# EAGLE design sensors (EAGLE 9.6.2)
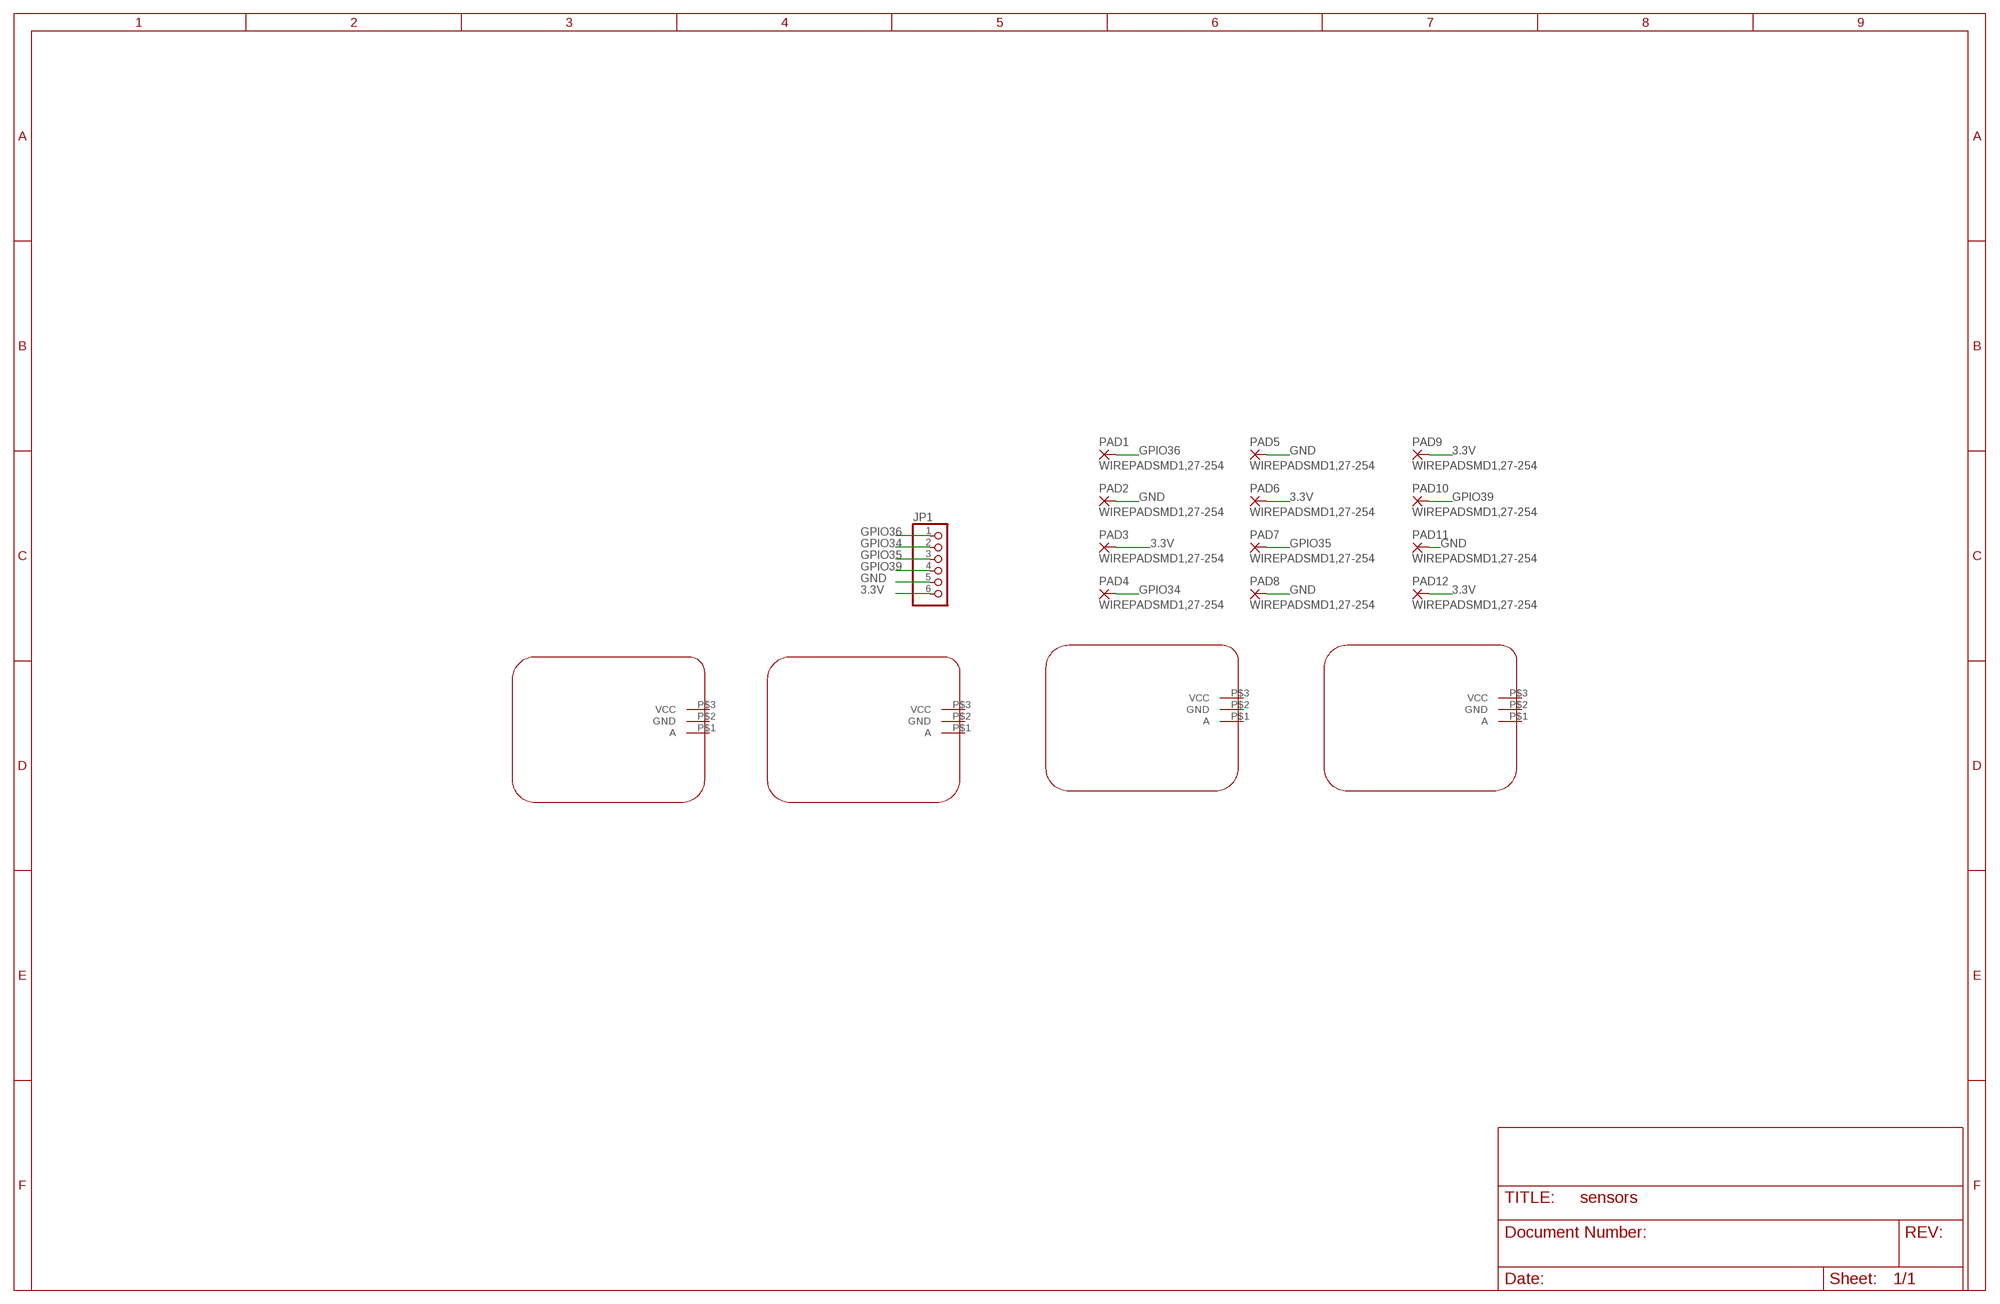
[diagram p0: schematic, sheet 1]

## Parts
JP1  PINHD-1X6  [1X06]
PAD1  WIREPADSMD1,27-254  [SMD1,27-2,54]
PAD2  WIREPADSMD1,27-254  [SMD1,27-2,54]
PAD3  WIREPADSMD1,27-254  [SMD1,27-2,54]
PAD4  WIREPADSMD1,27-254  [SMD1,27-2,54]
PAD5  WIREPADSMD1,27-254  [SMD1,27-2,54]
PAD6  WIREPADSMD1,27-254  [SMD1,27-2,54]
PAD7  WIREPADSMD1,27-254  [SMD1,27-2,54]
PAD8  WIREPADSMD1,27-254  [SMD1,27-2,54]
PAD9  WIREPADSMD1,27-254  [SMD1,27-2,54]
PAD10  WIREPADSMD1,27-254  [SMD1,27-2,54]
PAD11  WIREPADSMD1,27-254  [SMD1,27-2,54]
PAD12  WIREPADSMD1,27-254  [SMD1,27-2,54]
U$1  SEN0244  [PACKAGE]
U$2  SEN0244  [PACKAGE]
U$3  SEN0244  [PACKAGE]
U$4  SEN0244  [PACKAGE]

## Nets
3.3V: JP1.6 PAD3.1(P) PAD6.1(P) PAD9.1(P) PAD12.1(P)
GND: JP1.5 PAD2.1(P) PAD5.1(P) PAD8.1(P) PAD11.1(P)
GPIO34: JP1.2 PAD4.1(P)
GPIO35: JP1.3 PAD7.1(P)
GPIO36: JP1.1 PAD1.1(P)
GPIO39: JP1.4 PAD10.1(P)
Unconnected: U$1.P$1(A) U$1.P$2(GND) U$1.P$3(VCC) U$2.P$1(A) U$2.P$2(GND) U$2.P$3(VCC) U$3.P$1(A) U$3.P$2(GND) U$3.P$3(VCC) U$4.P$1(A) U$4.P$2(GND) U$4.P$3(VCC)

## Library data of the parts
JP1 = pinhead:PINHD-1X6: PIN HEADER
PAD1-PAD12 = wirepad:WIREPAD: Wire PAD connect wire on PCB
U$1-U$4 = untitled:SEN0244

## Board
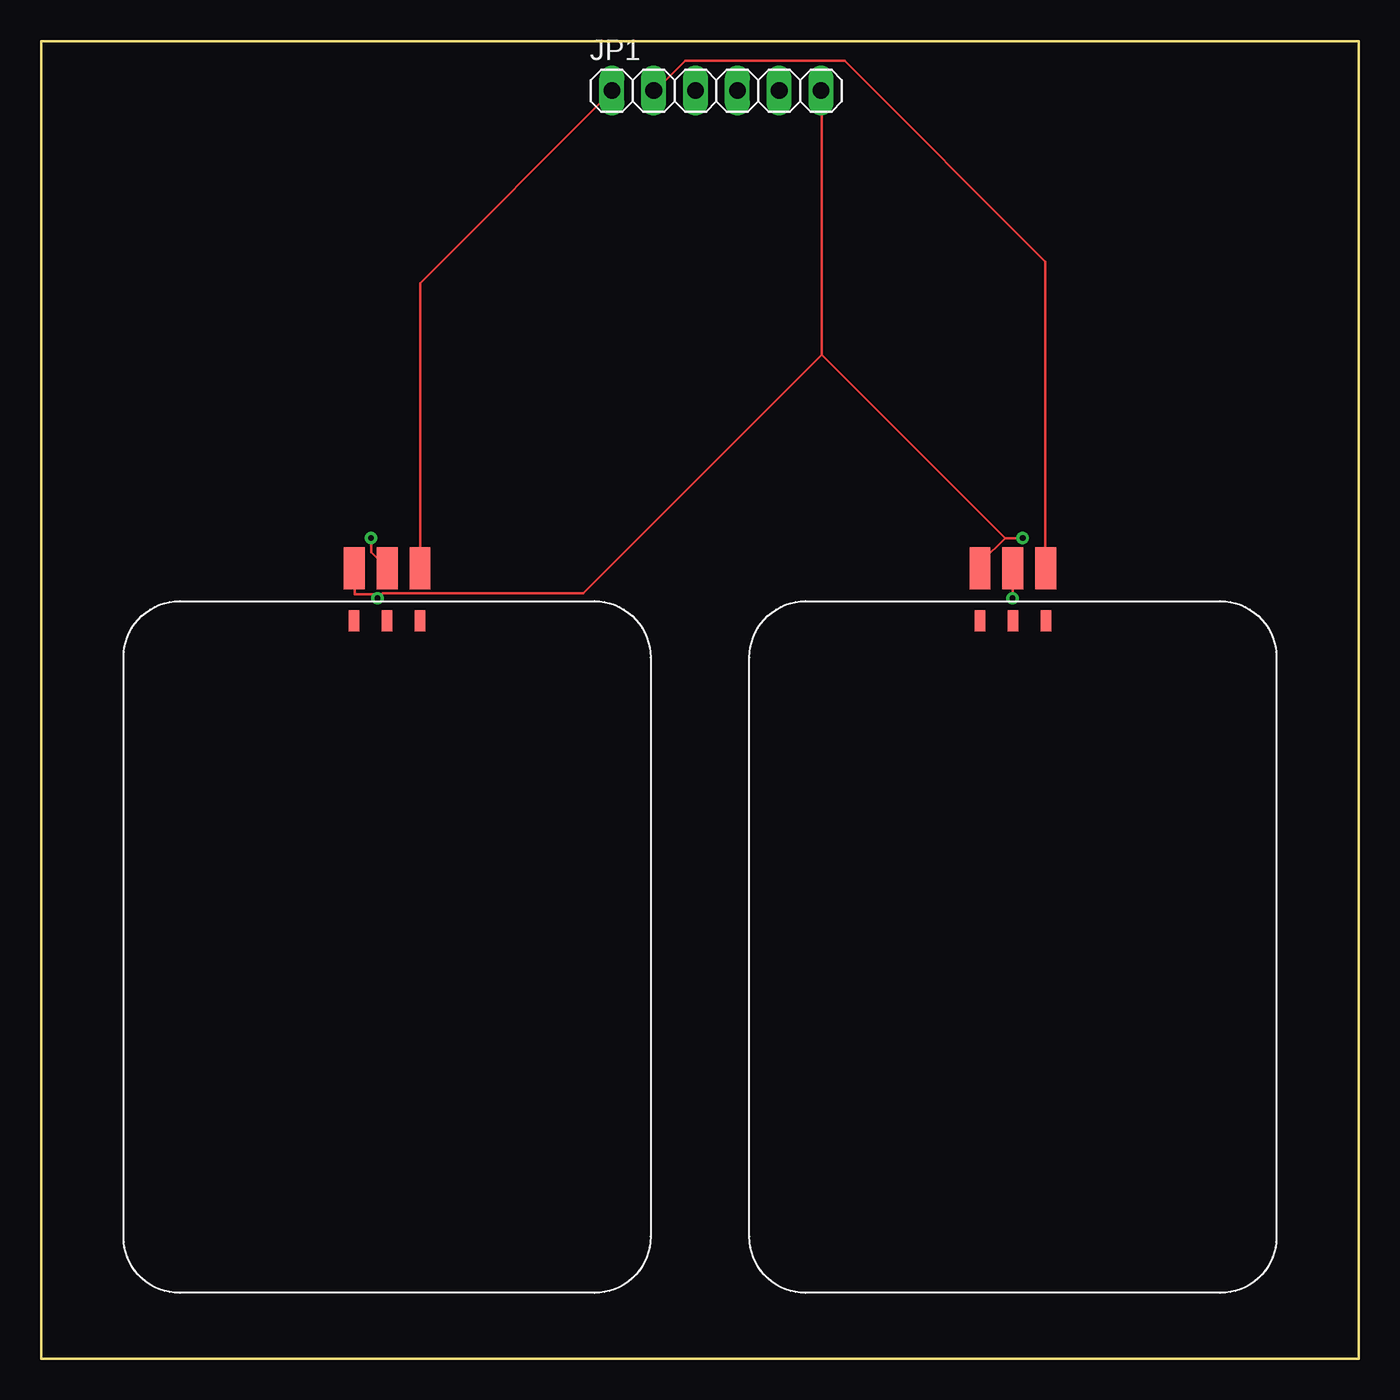
[diagram p1: board, top side]
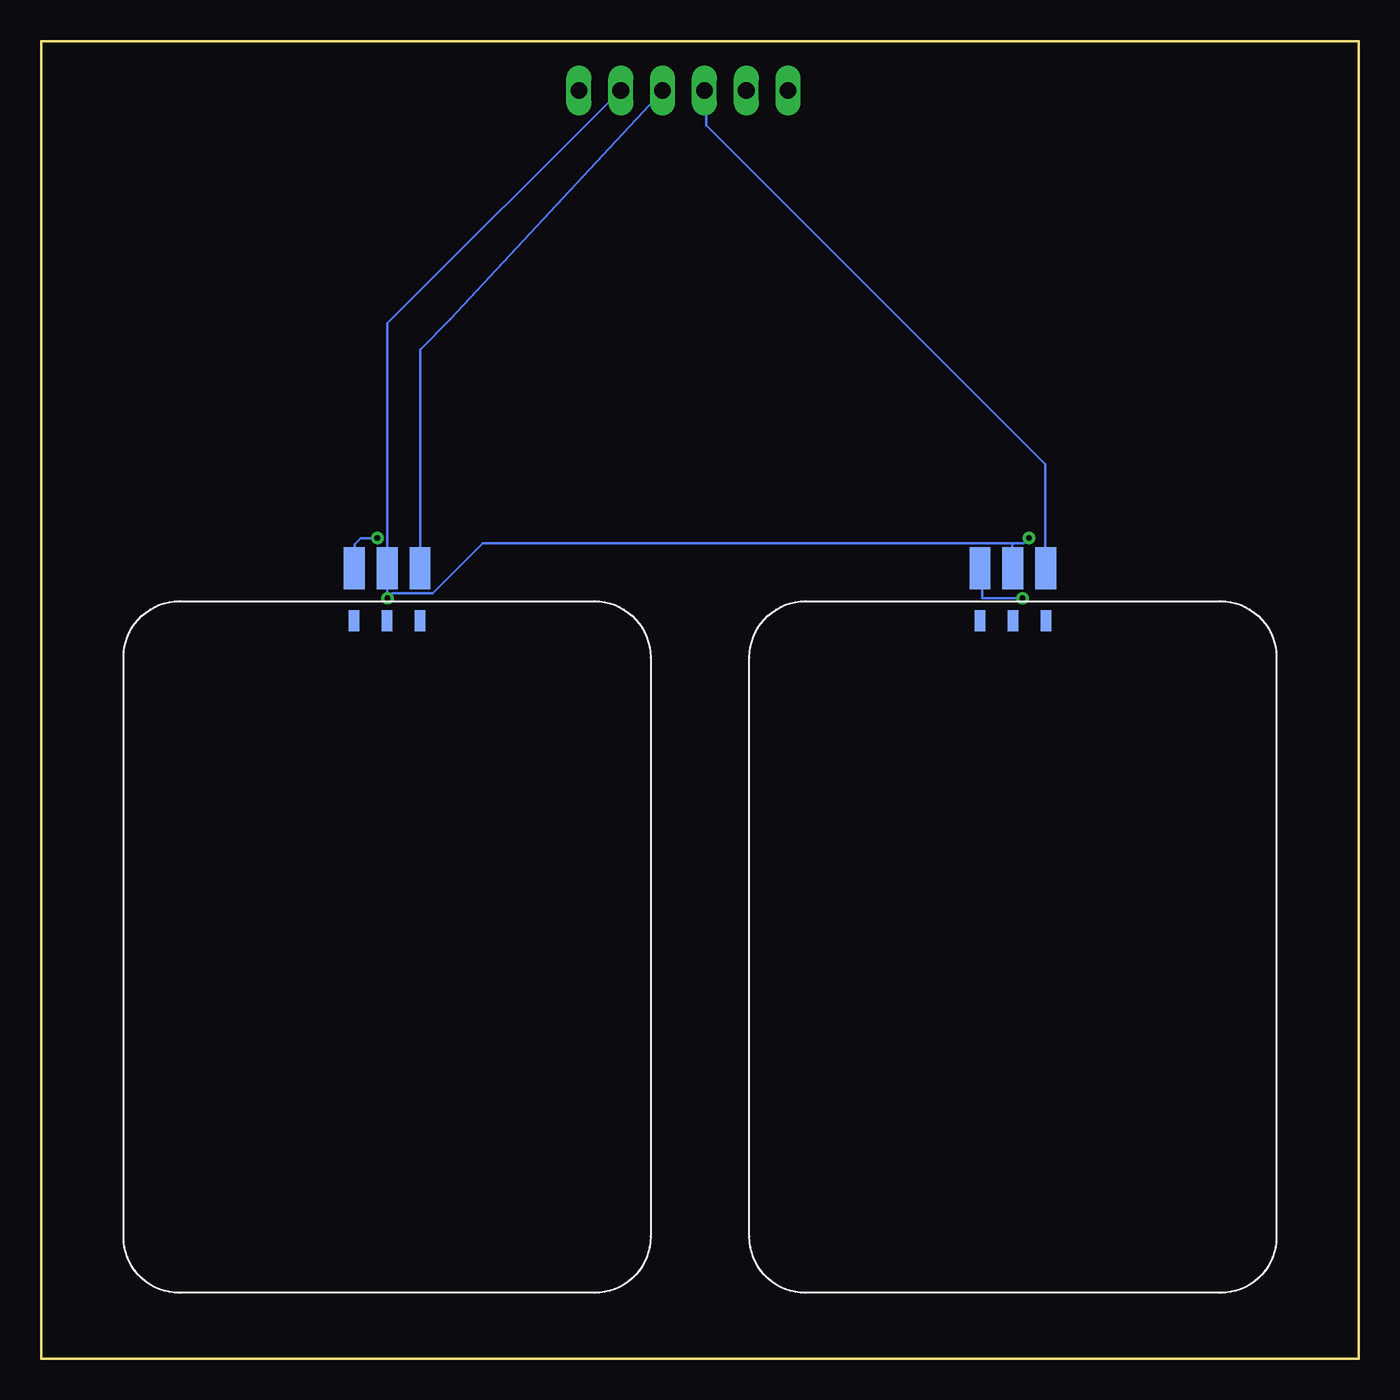
[diagram p2: board, bottom side, seen from below]

Size 80 x 80 mm. Coordinates in mm from the lower left corner, seen from the top.
Outline: 0,0 0,80 80,80 80,0 0,0
Copper layers (1*16): Top 0.035mm / dielectric 1.5mm / Bottom 0.035mm
Design rules "default": minimum track width 6mil, minimum drill 0.35mm, track to track 6mil, track to pad 6mil, pad to pad 6mil, via to via 6mil, smd to smd 6mil, copper to edge 40mil, drill to drill 6mil, minimum pad ring 10mil, minimum via ring 8mil, stop-mask expansion 4mil, vias tented up to drill 0mil, thermal gap 10mil

### Footprints (pad centres in the part's own frame; a part is rotated, then mirrored left to right if it is on the bottom)
1X06 = drill 1.016 long: 1 -6.35,0; 2 -3.81,0; 3 -1.27,0; 4 1.27,0; 5 3.81,0; 6 6.35,0
SMD1,27-2,54 = smd 1.27 x 2.54: 1 0,0
PACKAGE = smd 1.27 x 0.635: P$1 40.81,18; P$2 40.81,16; P$3 40.81,14

### Placement (x,y rotation side)
JP1  41,77 0 top
PAD1  23,48 0 top
PAD2  21,48 0 top
PAD3  19,48 0 top
PAD4  61,48 0 top
PAD5  59,48 0 top
PAD6  57,48 0 top
PAD7  19,48 0 bottom
PAD8  21,48 0 bottom
PAD9  23,48 0 bottom
PAD10  57,48 0 bottom
PAD11  59,48 0 bottom
PAD12  61,48 0 bottom
U$1  37,4 90 top
U$2  75,4 90 top
U$3  5,4 90 bottom
U$4  43,4 90 bottom

### Tracks (layer width: path | path; a pad name or v marks a point on that pad's centre or on a via)
3.3V  (via drill 0.35)
  Top 0.152: PAD3.1 19.05,47.85 19.05,46.43 20.17,46.43 v20.42,46.18 20.73,46.48 32.92,46.48 47.4,60.96 | 58.52,49.84 57.15,48.46 57.15,48.01 PAD6.1 | v59.59,49.84 58.52,49.84 | 47.4,60.96 47.4,76.89 JP1.6 | 58.52,49.84 47.4,60.96
  Bottom 0.152: v20.42,46.18 22.86,46.18 22.86,47.85 PAD9.1 | v59.59,49.84 60.59,49.84 60.96,49.46 60.96,48.01 PAD12.1
GND  (via drill 0.35)
  Top 0.152: v20.03,49.84 20.03,48.97 PAD8.1 | v58.98,46.18 58.98,47.85 PAD11.1
  Bottom 0.152: 21.03,49.53 21.03,48.01 PAD8.1 | 58.98,46.48 58.98,47.85 PAD11.1 58.98,48.01 58.98,62.87 44.85,77 JP1.5 | 21.03,49.53 53.19,49.53 56.24,46.48 58.67,46.48 v58.98,46.18 | 21.03,49.53 20.34,49.53 v20.03,49.84
GPIO34
  Top 0.152: PAD4.1 60.96,48.01 60.96,66.62 48.78,78.8 39.09,78.8 37.34,77.05 JP1.2
GPIO35
  Bottom 0.152: PAD7.1 19.05,48.01 19.05,54.32 39.62,74.89 39.62,76.89 JP1.3
GPIO36
  Top 0.152: PAD1.1 23.01,48.01 23.01,65.31 34.59,76.89 JP1.1
GPIO39
  Bottom 0.152: PAD10.1 57,61.27 55.16,63.11 JP1.4